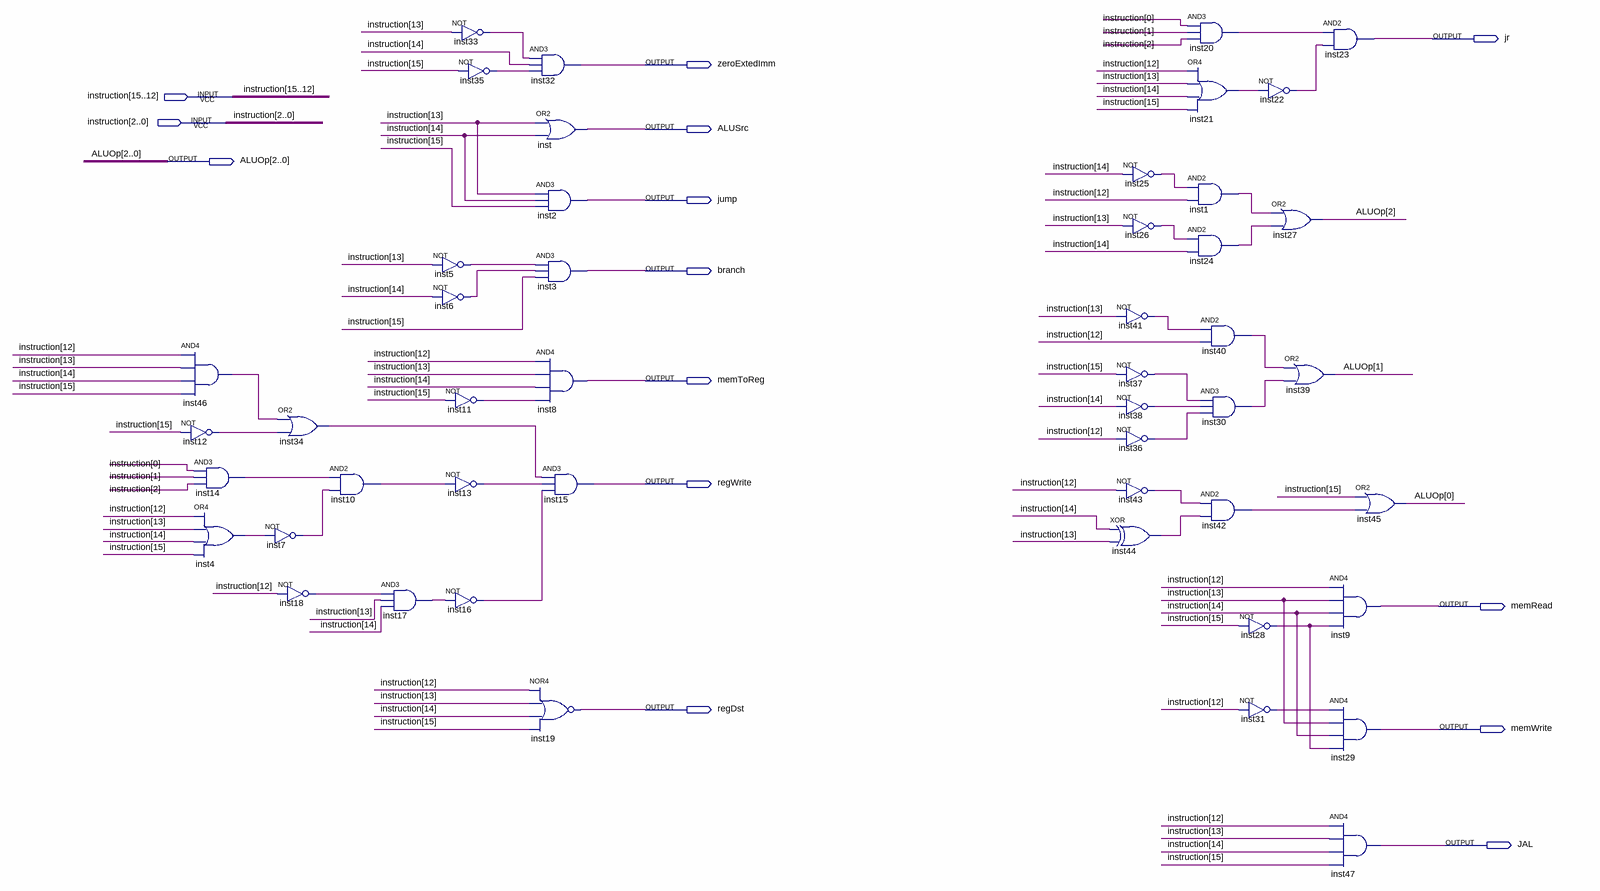
[diagram p0: schematic sheet]
// Quartus schematic ControlUnit.bdf as structural Verilog: 48 symbols, 14 pins
module ControlUnit (
  input  [15:0] instruction,
  output jr,
  output zeroExtedImm,
  output ALUSrc,
  output [2:0] ALUOp,
  output jump,
  output branch,
  output memToReg,
  output regWrite,
  output memRead,
  output regDst,
  output memWrite,
  output JAL
);

  wire inst1_out, inst4_out, inst5_out, inst6_out, inst7_out, inst10_out, inst11_out, inst12_out, inst13_out,
       inst14_out, inst16_out, inst17_out, inst18_out, inst20_out, inst21_out, inst22_out, inst24_out,
       inst25_out, inst26_out, inst28_out, inst30_out, inst31_out, inst33_out, inst34_out, inst35_out,
       inst36_out, inst37_out, inst38_out, inst40_out, inst41_out, inst42_out, inst43_out, inst44_out,
       inst46_out;

  and inst46 (inst46_out, instruction[12], instruction[13], instruction[14], instruction[15]);
  not inst12 (inst12_out, instruction[15]);
  and inst14 (inst14_out, instruction[0], instruction[1], instruction[2]);
  or inst4 (inst4_out, instruction[12], instruction[13], instruction[14], instruction[15]);
  or inst34 (inst34_out, inst46_out, inst12_out);
  not inst7 (inst7_out, inst4_out);
  not inst18 (inst18_out, instruction[12]);
  and inst10 (inst10_out, inst14_out, inst7_out);
  and inst17 (inst17_out, inst18_out, instruction[13], instruction[14]);
  not inst33 (inst33_out, instruction[13]);
  not inst35 (inst35_out, instruction[15]);
  not inst5 (inst5_out, instruction[13]);
  not inst6 (inst6_out, instruction[14]);
  not inst11 (inst11_out, instruction[15]);
  not inst13 (inst13_out, inst10_out);
  not inst16 (inst16_out, inst17_out);
  and inst32 (zeroExtedImm, inst33_out, instruction[14], inst35_out);
  or inst (ALUSrc, instruction[13], instruction[14]);
  and inst2 (jump, instruction[13], instruction[14], instruction[15]);
  and inst3 (branch, inst5_out, inst6_out, instruction[15]);
  and inst8 (memToReg, instruction[12], instruction[13], instruction[14], inst11_out);
  and inst15 (regWrite, inst34_out, inst13_out, inst16_out);
  nor inst19 (regDst, instruction[12], instruction[13], instruction[14], instruction[15]);
  not inst25 (inst25_out, instruction[14]);
  not inst26 (inst26_out, instruction[13]);
  not inst41 (inst41_out, instruction[13]);
  not inst37 (inst37_out, instruction[15]);
  not inst38 (inst38_out, instruction[14]);
  not inst36 (inst36_out, instruction[12]);
  not inst43 (inst43_out, instruction[12]);
  xor inst44 (inst44_out, instruction[14], instruction[13]);
  and inst20 (inst20_out, instruction[0], instruction[1], instruction[2]);
  or inst21 (inst21_out, instruction[12], instruction[13], instruction[14], instruction[15]);
  and inst1 (inst1_out, inst25_out, instruction[12]);
  and inst24 (inst24_out, inst26_out, instruction[14]);
  and inst40 (inst40_out, inst41_out, instruction[12]);
  and inst30 (inst30_out, inst37_out, inst38_out, inst36_out);
  and inst42 (inst42_out, inst43_out, inst44_out);
  not inst28 (inst28_out, instruction[15]);
  not inst31 (inst31_out, instruction[12]);
  not inst22 (inst22_out, inst21_out);
  or inst27 (ALUOp[2], inst1_out, inst24_out);
  or inst39 (ALUOp[1], inst40_out, inst30_out);
  and inst23 (jr, inst20_out, inst22_out);
  and inst9 (memRead, instruction[12], instruction[13], instruction[14], inst28_out);
  and inst29 (memWrite, inst31_out, instruction[13], instruction[14], inst28_out);
  and inst47 (JAL, instruction[12], instruction[13], instruction[14], instruction[15]);
  or inst45 (ALUOp[0], instruction[15], inst42_out);
endmodule
